# EAGLE design MoteinoShield (EAGLE 9.6.2)
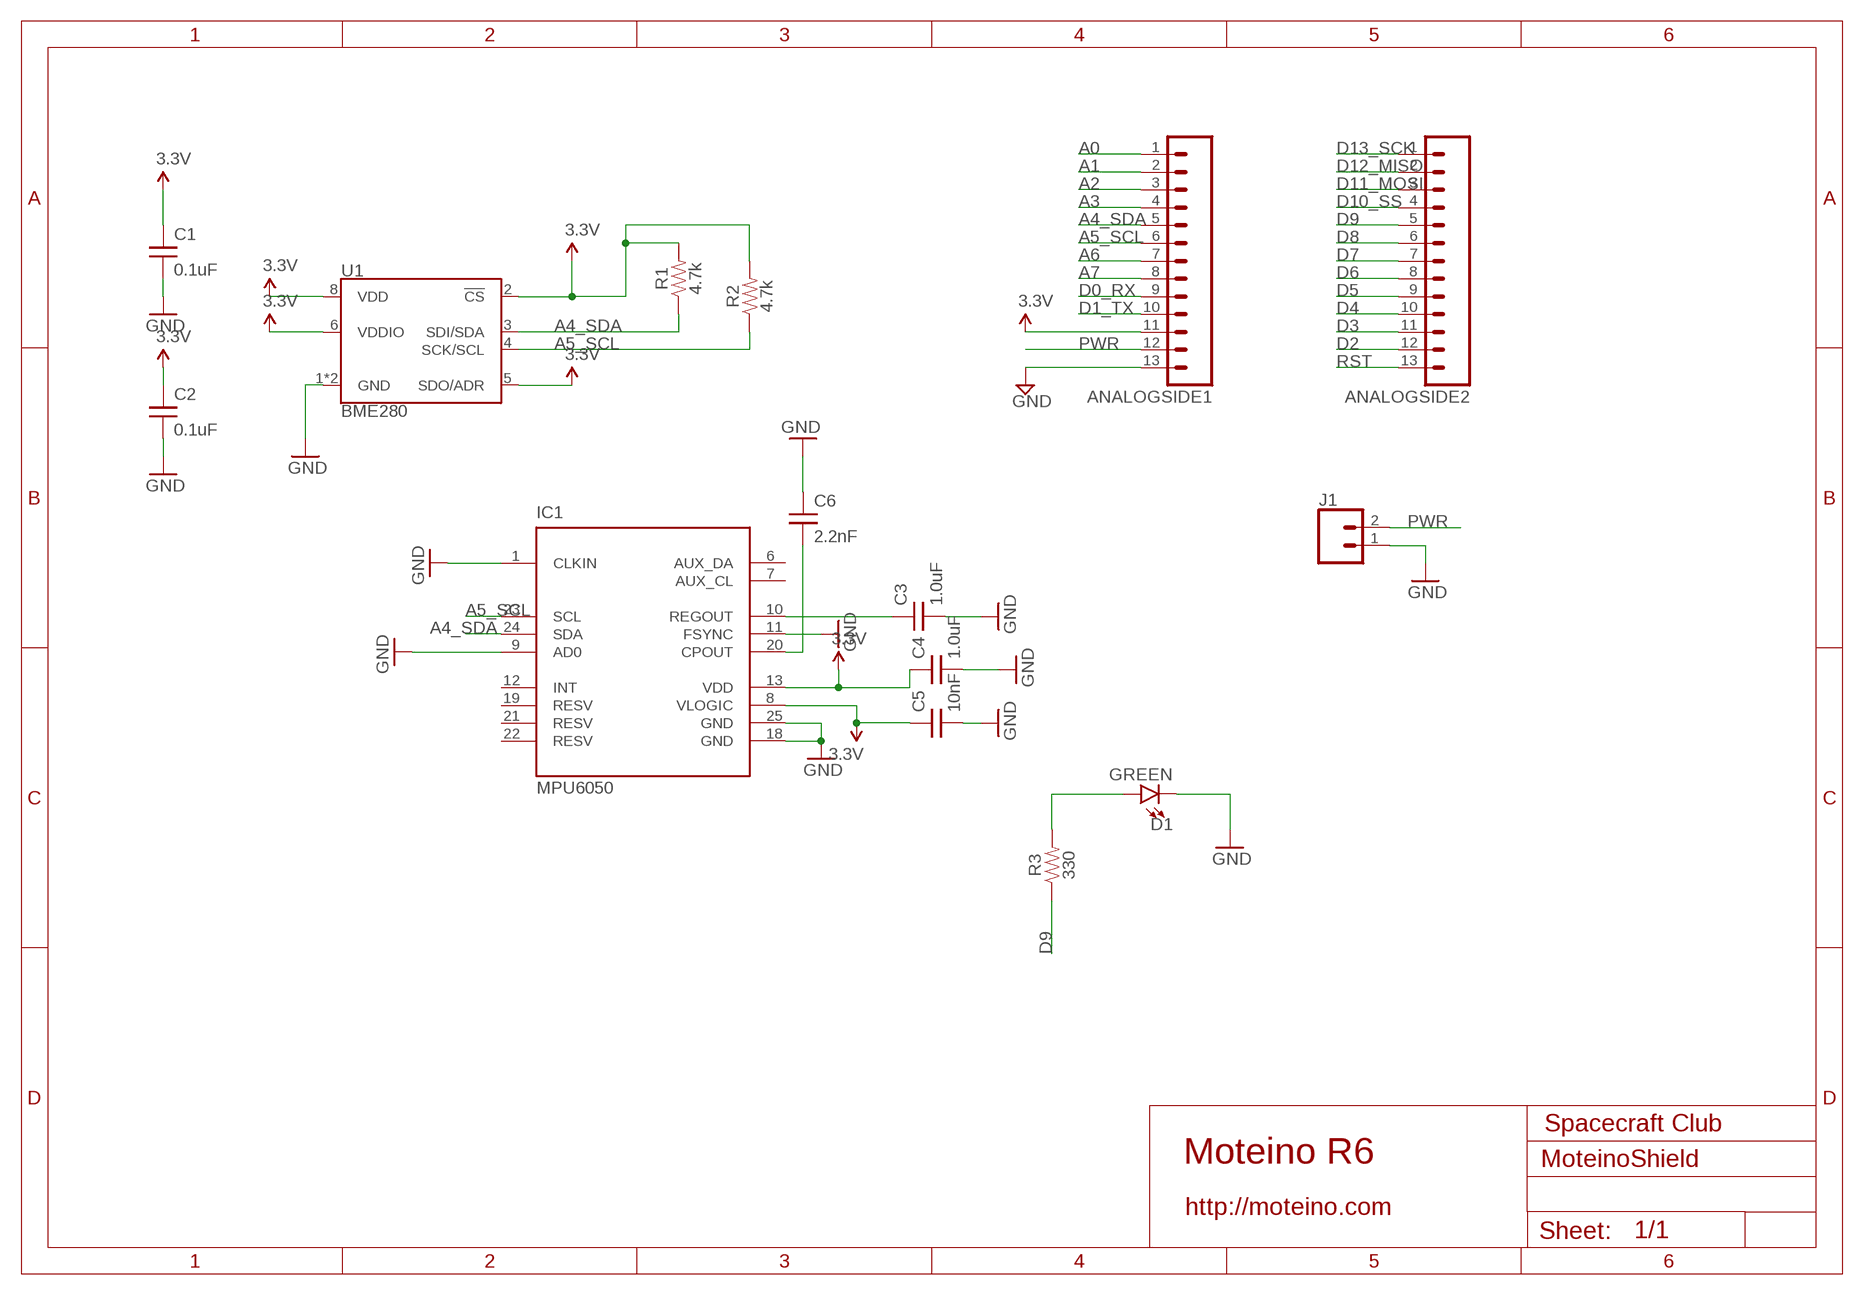
[diagram p0: schematic, sheet 1]

## Parts
ANALOGSIDE1  HDR_13PINTHIN_RINGS  [1X13_THINRINGS]
ANALOGSIDE2  HDR_13PINTHIN_RINGS  [1X13_THINRINGS]
C1  0.1uF  CAPACITOR_0.1UF  [0603-CAP]
C2  0.1uF  CAPACITOR_0.1UF  [0603-CAP]
C3  1.0uF  CAPACITOR_1.0UF-0603-16V-10%  [0603]
C4  1.0uF  CAPACITOR_1.0UF-0603-16V-10%  [0603]
C5  10nF  CAPACITOR_10NF-0603-50V-10%  [0603]
C6  2.2nF  CAPACITOR_10UF-0603-6.3V-20%  [0603]
D1  GREEN  LED_GREEN0603  [LED-0603]
IC1  MPU6050  [QFN50P400X400X95-25T265X275N]
J1  CONNECTOR_2PINJST-PTH-2  [JST-2-PTH]
R1  4.7k  RESISTOR_4.7KOHM-0603-1/10W-1%  [0603]
R2  4.7k  RESISTOR_4.7KOHM-0603-1/10W-1%  [0603]
R3  330  RESISTOR_330OHM-0603-1/10W-1%  [0603]
U1  BME280  [LGA-8-2.5X2.5]

## Nets
3.3V: C1.1 C2.1 C4.1 C5.1 IC1.8(VLOGIC) IC1.13(VDD) R1.2 R2.2 U1.2(!CS) U1.5(SDO/ADR) U1.6(VDDIO) U1.8(VDD)
A0: ANALOGSIDE1.1
A1: ANALOGSIDE1.2
A2: ANALOGSIDE1.3
A3: ANALOGSIDE1.4
A4_SDA: ANALOGSIDE1.5 IC1.24(SDA) R1.1 U1.3(SDI/SDA)
A5_SCL: ANALOGSIDE1.6 IC1.23(SCL) R2.1 U1.4(SCK/SCL)
A6: ANALOGSIDE1.7
A7: ANALOGSIDE1.8
D0_RX: ANALOGSIDE1.9
D1_TX: ANALOGSIDE1.10
D2: ANALOGSIDE2.12
D3: ANALOGSIDE2.11
D4: ANALOGSIDE2.10
D5: ANALOGSIDE2.9
D6: ANALOGSIDE2.8
D7: ANALOGSIDE2.7
D8: ANALOGSIDE2.6
D9: ANALOGSIDE2.5 R3.1
D10_SS: ANALOGSIDE2.4
D11_MOSI: ANALOGSIDE2.3
D12_MISO: ANALOGSIDE2.2
D13_SCK: ANALOGSIDE2.1
GND [power]: ANALOGSIDE1.13 C1.2 C2.2 C3.2 C4.2 C5.2 C6.1 D1.C IC1.1(CLKIN) IC1.9(AD0) IC1.11(FSYNC) IC1.18(GND) IC1.25(GND) J1.1 U1.1(GND) U1.7(GND)
N$1: D1.A R3.2
N$3: C3.1 IC1.10(REGOUT)
N$4: C6.2 IC1.20(CPOUT)
PWR [power]: ANALOGSIDE1.12 J1.2
RST: ANALOGSIDE2.13
VCC: ANALOGSIDE1.11 ; supply symbol labelled 3.3V
Unconnected: IC1.2(NC) IC1.3(NC) IC1.4(NC) IC1.5(NC) IC1.6(AUX_DA) IC1.7(AUX_CL) IC1.12(INT) IC1.14(NC) IC1.15(NC) IC1.16(NC) IC1.17(NC) IC1.19(RESV) IC1.21(RESV) IC1.22(RESV)

## Notes on the sheet
- Spacecraft Club
- Moteino R6
- http://moteino.com

## Library data of the parts
ANALOGSIDE1 ANALOGSIDE2 = LowPowerLab:HDR_13PIN
C1 C2 = Femtosat:CAPACITOR_0.1UF: CAP-00810 Ceramic Standard decoupling cap; DIGIKEY: 311-1343-1-ND
C3 C4 = Femtosat:CAPACITOR_1.0UF: 1µF ceramic capacitors A capacitor is a passive two-terminal electrical component used to store electrical energy temporarily in an electric field.; DIGIKEY: 399-3118-1-ND
C5 = Femtosat:CAPACITOR_10NF: 0.01uF/10nF/10,000pF ceramic capacitors A capacitor is a passive two-terminal electrical component used to store electrical energy temporarily in an electric field. Adapted from SparkFun Libraries; DIGIKEY: 399-1091-1-ND
C6 = Femtosat:CAPACITOR_10UF: 10.0µF ceramic capacitors A capacitor is a passive two-terminal electrical component used to store electrical energy temporarily in an electric field.; DIGIKEY: 490-3896-1-ND; VALUE: 10uF
D1 = Femtosat:LED_GREEN: Green SMD LED Good as an indicator for power or to be controlled by a microcontroller Packages: 0603 - SMD 0603 package [Product Link] <https://www.digikey.com/product-detail/en/lite-on-inc/LTST-C190GKT/160-1183-1-ND/269255> Adapted fromt the SparkFun Libraries; DIGIKEY: 160-1183-1-ND
IC1 = invensense:MPU6050: The triple-axis MEMS gyroscope
J1 = Femtosat:CONNECTOR_2PIN: 2 pin connector 1X02 variant Can be used for soldering on wires or pins. JST-PTH variant is a through hole battery connector for SparkFun batteries JST-SMT variant is a surface mount battery connector for SparkFun batteries; DIGIKEY: 455-1719-ND
R1 R2 = Femtosat:RESISTOR_4.7KOHM: 4.7k Ohm resistor A resistor is a passive two-terminal electrical component that implements electrical resistance as a circuit element. Resistors act to reduce current flow, and, at the same time, act to lower voltage levels within circuits. - Wikipedia; DIGIKEY: 311-4.7KGRCT-ND
R3 = Femtosat:RESISTOR_330OHM: 330 Ohm resistor A resistor is a passive two-terminal electrical component that implements electrical resistance as a circuit element. Resistors act to reduce current flow, and, at the same time, act to lower voltage levels within circuits. - Wikipedia; DIGIKEY: 311-330GRCT-ND
U1 = Femtosat:BME280: Bosch BME280 – Combined Humidity and Pressure Sensor The BME280 is as combined digital humidity, pressure and temperature sensor based on proven sensing principles. The sensor module is housed in an extremely compact metal-lid LGA package with a footprint of only 2.5×2.5mm² with a height of 0.93mm. Its small dimensions and its low power consumption allow the implementation in battery driven devices such as handsets, GPS modules or watches. Datasheet <https://cdn.sparkfun.com/assets/learn_tutorials/4/1/9/BST-BME280_DS001-10.pdf> Adapted from the SparkFun Libraries; DIGIKEY: 828-1063-1-ND

## Net classes
1 power: width 0.381 mm, clearance 0.254 mm

## Board
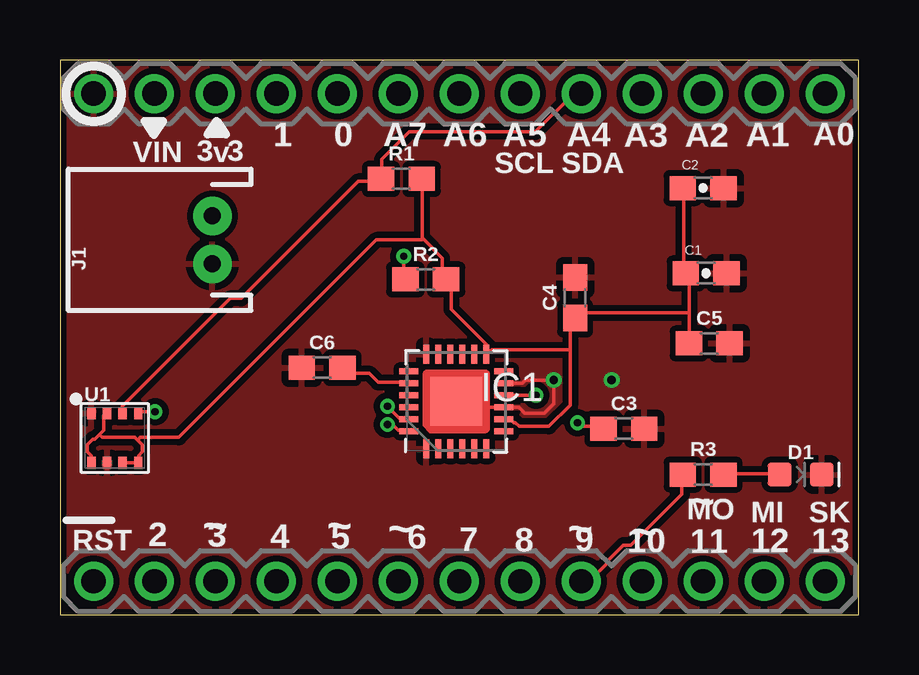
[diagram p1: board, top side]
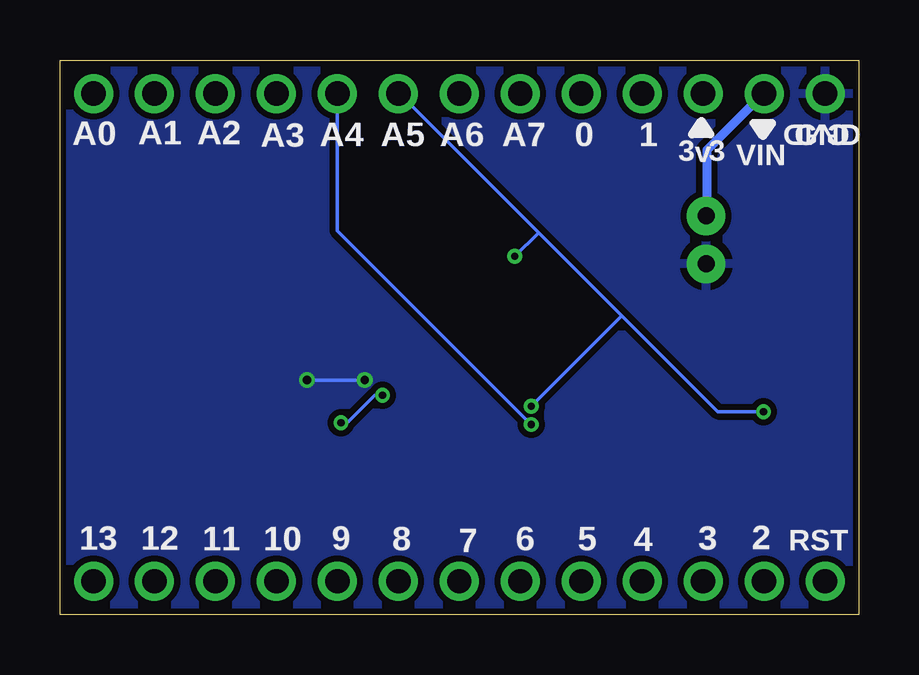
[diagram p2: board, bottom side, seen from below]

Size 33.27 x 23.11 mm. Coordinates in mm from the lower left corner, seen from the top.
Outline: 0,0 33.27,0 33.27,23.11 0,23.11 0,0
Copper layers (1*16): Top 0.035mm / dielectric 1.5mm / Bottom 0.035mm
Design rules "ITEADstudio_DRC *": minimum track width 6mil, minimum drill 12mil, track to track 6mil, track to pad 6mil, pad to pad 6mil, via to via 6mil, smd to smd 0mil, copper to edge 10mil, drill to drill 10mil, minimum pad ring 10mil, minimum via ring 6mil, stop-mask expansion 2mil, vias tented up to drill 100mil, thermal gap 12mil

### Footprints (pad centres in the part's own frame; a part is rotated, then mirrored left to right if it is on the bottom)
1X13_THINRINGS = drill 1.016 pad 1.626: 1 0,0; 2 2.54,0; 3 5.08,0; 4 7.62,0; 5 10.16,0; 6 12.7,0; 7 15.24,0; 8 17.78,0; 9 20.32,0; 10 22.86,0; 11 25.4,0; 12 27.94,0; 13 30.48,0
0603-CAP = smd 1.1 x 1: 1 -0.85,0; 2 0.85,0
0603 = smd 1.1 x 1: 1 -0.85,0; 2 0.85,0
LED-0603 = smd 1 x 1: A -0.877,0; C 0.877,0
QFN50P400X400X95-25T265X275N = smd 0.26 x 0.79: 1 -1.25,-1.97; 2 -0.75,-1.97; 3 -0.25,-1.97; 4 0.25,-1.97; 5 0.75,-1.97; 6 1.25,-1.97; 13 1.25,1.97; 14 0.75,1.97; 15 0.25,1.97; 16 -0.25,1.97; 17 -0.75,1.97; 18 -1.25,1.97 | smd 0.79 x 0.26: 7 1.97,-1.25; 8 1.97,-0.75; 9 1.97,-0.25; 10 1.97,0.25; 11 1.97,0.75; 12 1.97,1.25; 19 -1.97,1.25; 20 -1.97,0.75; 21 -1.97,0.25; 22 -1.97,-0.25; 23 -1.97,-0.75; 24 -1.97,-1.25 | smd 2.15 x 2.05: 25 0,0
JST-2-PTH = drill 0.7 pad 1.6: 1 -1,0; 2 1,0
LGA-8-2.5X2.5 = smd 0.35 x 0.5: 1 -0.975,1.025; 2 -0.325,1.025; 3 0.325,1.025; 4 0.975,1.025; 5 0.975,-1.025; 6 0.325,-1.025; 7 -0.325,-1.025; 8 -0.975,-1.025

### Placement (x,y rotation side)
ANALOGSIDE1  31.88,21.72 180 top
ANALOGSIDE2  31.88,1.4 180 top
C1  26.92,14.22 0 top
C2  26.8,17.78 0 top
C3  23.5,7.75 0 top
C4  21.46,13.21 90 top
C5  27.05,11.3 0 top
C6  10.92,10.29 0 top
D1  30.86,5.84 0 top
IC1  16.51,8.89 0 top
J1  6.35,15.62 90 top
R1  14.22,18.16 0 top
R2  15.24,13.97 0 top
R3  26.8,5.84 0 top
U1  2.29,7.37 0 top

### Tracks (layer width: path | path; a pad name or v marks a point on that pad's centre or on a via)
3.3V
  Top 0.152: 26.21,12.57 26.21,14.1 26.14,14.17 C1.1 26.06,14.25 25.98,14.33 25.98,17.75 C2.1 | 26.21,12.57 26.21,11.35 C5.1 | 21.26,11.05 21.26,12.19 21.41,12.34 C4.1 21.49,12.42 21.64,12.57 26.21,12.57 | 21.26,11.05 21.26,8.74 20.37,7.85 19.13,7.85 18.97,8 18.9,8 18.82,8.08 18.52,8.08 IC1.8 | U1.6 2.67,6.33 3.2,6.33 U1.5 3.28,6.4 3.28,6.63 3.43,6.78 3.43,7.09 3.24,7.28 | 1.64,7.51 1.83,7.7 1.83,8.31 1.91,8.38 U1.2 | 1.64,7.51 1.45,7.32 1.37,7.32 1.14,7.09 1.14,6.78 1.29,6.63 1.29,6.4 U1.8 | 3.24,7.28 3.12,7.39 1.75,7.39 1.64,7.51 | 15.13,15.66 15.93,14.86 15.93,14.17 16.08,14.02 R2.2 16.15,13.95 16.31,13.79 16.31,12.72 17.75,11.28 17.75,10.9 IC1.13 17.83,10.9 17.98,11.05 21.26,11.05 | 15.13,15.66 15.09,15.7 15.09,18.14 R1.2 | 3.24,7.28 3.35,7.39 4.95,7.39 13.18,15.62 15.09,15.62 15.13,15.66
A4_SDA  (via drill 0.3)
  Top 0.152: U1.3 2.59,8.46 2.59,8.69 7.09,13.18 7.54,13.18 12.42,18.06 13.26,18.06 13.34,18.14 R1.1 13.41,18.21 13.41,18.97 14.55,20.12 19.81,20.12 21.41,21.72 ANALOGSIDE1.5 | v13.64,7.92 13.87,7.92 14.1,7.7 14.48,7.7 IC1.24
  Bottom 0.152: v13.64,7.92 21.72,16 ANALOGSIDE1.5
A5_SCL  (via drill 0.3)
  Top 0.152: v3.96,8.46 3.28,8.46 U1.4 | v13.64,8.69 14.17,8.15 14.48,8.15 IC1.23 | v14.33,14.94 14.33,14.02 R2.1
  Bottom 0.152: v3.96,8.46 5.87,8.46 9.87,12.46 | 13.34,15.93 19.13,21.72 ANALOGSIDE1.6 | 13.34,15.93 9.87,12.46 | 9.87,12.46 v13.64,8.69 | 13.34,15.93 v14.33,14.94
D9
  Top 0.152: R3.1 25.91,5.79 25.91,5.03 23.77,2.9 23.47,2.9 22.78,2.21 22.78,2.13 22.1,1.45 21.72,1.45 ANALOGSIDE2.5
GND  (via drill 0.35)
  Top 0.152: IC1.11 18.49,9.65 19.25,9.65 19.38,9.78 v20.57,9.78 20.57,8.79 20.17,8.39 19.37,8.39 19.11,8.64 IC1.9 16.76,8.64 IC1.25
  Bottom 0.152: v20.57,9.78 v22.99,9.78
  pour Top: 0,23.11 33.4,23.11 33.4,0 0,0
  pour Bottom: 0,23.11 33.27,23.11 33.27,0 0,0
N$1
  Top 0.152: D1.A 29.95,5.87 27.66,5.87 R3.2
N$3  (via drill 0.3)
  Top 0.152: v19.84,9.14 18.52,9.14 IC1.10 | v21.57,8 21.72,7.85 22.55,7.85 22.63,7.77 C3.1
  Bottom 0.152: v19.84,9.14 20.17,9.14 21.31,8 v21.57,8
N$4
  Top 0.152: IC1.20 14.48,9.68 13.26,9.68 12.88,10.06 12.04,10.06 11.81,10.29 C6.2
PWR
  Bottom 0.381: J1.2 6.33,16.69 6.33,19.36 3.96,21.72 ANALOGSIDE1.12

### Text on the board
tPlace: 1 | 0 | A7 | A6 | A5 | A4 | A1 | VIN | 3 | v | 3 | A3 | A2 | A0 | SCL | SDA | 2 | 3 | 4 | 5 | 6 | 7 | 8 | 9 | 10 | MO | ~ | 11 | MI | 12 | SK | 13 | RST | ~ | ~ | ~ | ~ | ~
bPlace: 1 | 0 | A7 | A6 | A5 | A4 | A2 | A1 | A0 | GND | GND | VIN | 3 | v | 3 | A3 | 2 | 3 | 4 | 5 | 6 | 7 | 8 | 9 | 10 | 11 | 12 | 13 | RST